# Altium schematic sheet Trottinette_Telemetrie_overview.SchDoc
size Tabloid; Date: Date; Author: Author 1; Revision: 1; SheetNumber: 2; SheetTotal: 4; Size: 11x17; Sheet_Name: Schéma fonctionnel
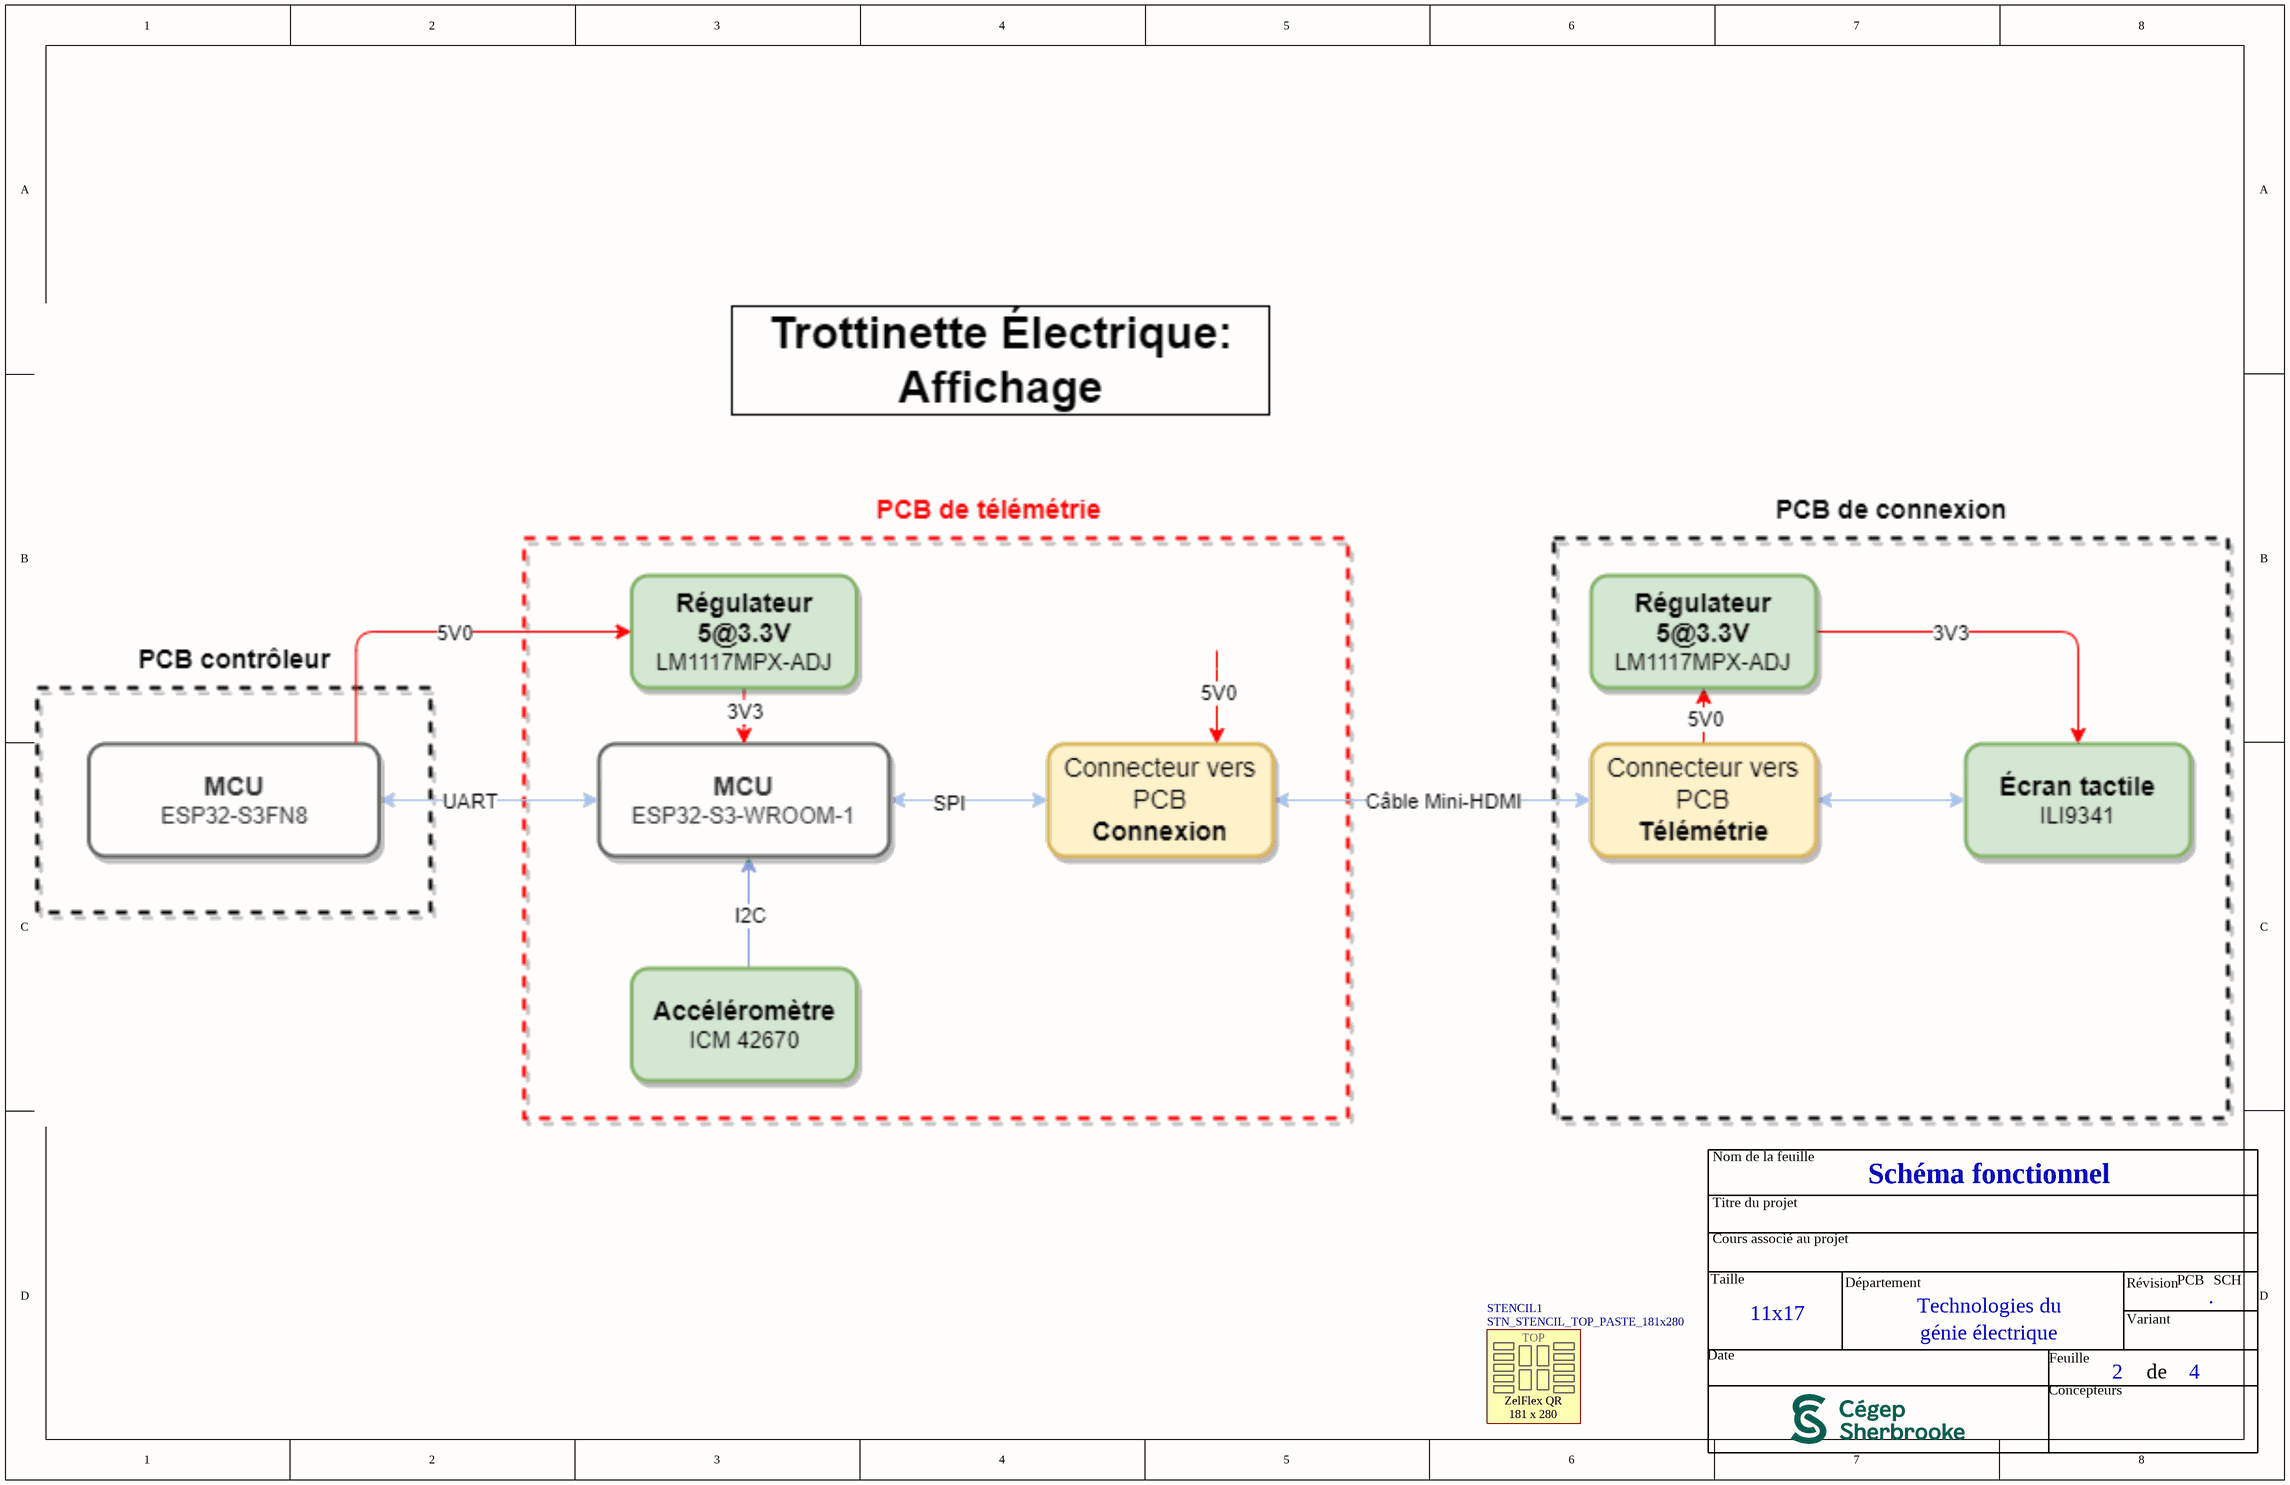
[diagram p0: Trottinette_Telemetrie_overview.SchDoc]

## Parts
STENCIL1  STN_STENCIL_TOP_PASTE_181x280  [STN_STENCIL_TOP_PASTE_181x280]  (no BOM)

## Notes on the sheet
- Nom de la feuille
- Titre du projet
- Cours associé au projet
- Taille
- Département
- Technologies du
- Révision
- PCB
- .
- SCH
- Date
- génie électrique
- Feuille
- Variant
- de
- Concepteurs
- (in symbol CMP-535-000002-8) TOP; ZelFlex QR; 181 x 280

## Library data of the parts
STENCIL1 = CMP-535-000002-8: MEC - STENCIL TOP PASTE - 181x280; Magnetic Material: NO; Assembly Type: NONE; Manufacturer #1: *; Part Number #1: *; Source: Schlib1.SchLib; Value: *; Package: *; Pin Count: 0; Design Item ID: STN_STENCIL_TOP_PASTE_LPKF_ZELFLEX-181x280; Temperature: *; Current Rating: *; Power Max: *; Tolerance: *; Voltage Rating: *; Polarized: *; Component Type: Standard (No BOM); Note: *